# Altium schematic sheet USB To Serial.SchDoc
size A4
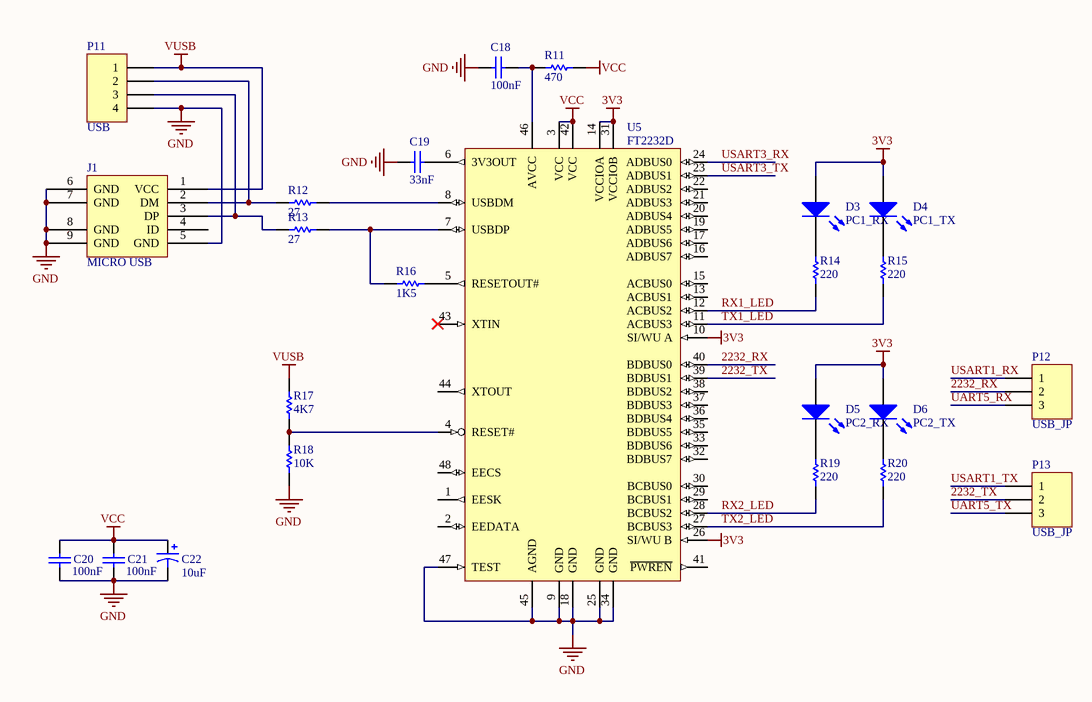
[diagram p0: USB To Serial.SchDoc]

## Parts
C18  100nF  [0603-CAP]
C19  33nF  [0603-CAP]
C20  100nF  [0603-CAP]
C21  100nF  [0603-CAP]
C22  10uF  [SV-C]
D3  PC1_RX  [CHIPLED_0603]
D4  PC1_TX  [CHIPLED_0603]
D5  PC2_RX  [CHIPLED_0603]
D6  PC2_TX  [CHIPLED_0603]
J1  MICRO USB  [USB_MICRO]
P11  USB  [HDR1X4]
P12  USB_JP  [HDR1X3]
P13  USB_JP  [HDR1X3]
R11  470  [0603-RES]
R12  27  [0603-RES]
R13  27  [0603-RES]
R14  220  [0603-RES]
R15  220  [0603-RES]
R16  1K5  [0603-RES]
R17  4K7  [0603-RES]
R18  10K  [0603-RES]
R19  220  [0603-RES]
R20  220  [0603-RES]
U5  FT2232D  [QFP-48N]

## Nets
3V3: D3.1(A) D4.1(A) D5.1(A) D6.1(A) U5.10(SI/WU_A) U5.14(VCCIOA) U5.26(SI/WU_B) U5.31(VCCIOB)
GND: C18.1 C19.1 C20.1 C21.1 C22.2 J1.5(GND) J1.6(GND) J1.7(GND) J1.8(GND) J1.9(GND) P11.4 R18.1 U5.9(GND) U5.18(GND) U5.25(GND) U5.34(GND) U5.45(AGND) U5.47(TEST)
VCC: C20.2 C21.2 C22.1 R11.2 U5.3(VCC) U5.42(VCC)
VUSB: J1.1(VCC) P11.1 R17.2
2232_RX: P12.2 U5.40(BDBUS0)
2232_TX: P13.2 U5.39(BDBUS1)
RX1_LED: R14.1 U5.12(ACBUS2)
RX2_LED: R19.1 U5.28(BCBUS2)
TX1_LED: R15.1 U5.11(ACBUS3)
TX2_LED: R20.1 U5.27(BCBUS3)
UART5_RX: P12.3
UART5_TX: P13.3
USART1_RX: P12.1
USART1_TX: P13.1
USART3_RX: U5.24(ADBUS0)
USART3_TX: U5.23(ADBUS1)
NetC18_2: C18.2 R11.1 U5.46(AVCC)
NetC19_2: C19.2 U5.6(3V3OUT)
NetD3_2: D3.2(K) R14.2
NetD4_2: D4.2(K) R15.2
NetD5_2: D5.2(K) R19.2
NetD6_2: D6.2(K) R20.2
NetJ1_2: J1.2(DM) P11.2 R12.1
NetJ1_3: J1.3(DP) P11.3 R13.1
NetR12_2: R12.2 U5.8(USBDM)
NetR13_2: R13.2 R16.1 U5.7(USBDP)
NetR16_2: R16.2 U5.5(RESETOUT#)
NetR17_1: R17.1 R18.2 U5.4(RESET#)

Not connected (* = marked no-connect by the designer): J1 4(ID); U5 1(EESK) 2(EEDATA) 13(ACBUS1) 15(ACBUS0) 16(ADBUS7) 17(ADBUS6) 19(ADBUS5) 20(ADBUS4) 21(ADBUS3) 22(ADBUS2) 29(BCBUS1) 30(BCBUS0) 32(BDBUS7) 33(BDBUS6) 35(BDBUS5) 36(BDBUS4) 37(BDBUS3) 38(BDBUS2) 41(~{PWREN}) 43(XTIN)* 44(XTOUT) 48(EECS)

## Library data of the parts
C18-C21 = Cap: Capacitor; Published: 8-Jun-2000; LatestRevisionDate: 17-Jul-2002; LatestRevisionNote: Re-released for DXP Platform.; PackageReference: RAD-0.3; Publisher: Altium Limited; PackageDescription: Radial Cap, Thru-Hole; 2 Leads; 0.3 in Pin Spacing
  C18 C20 C21: Value: 100nF
  C19: Value: 33nF
C22 = Cap Pol: Polarized Capacitor (Axial); Published: 8-Jun-2000; LatestRevisionDate: 17-Jul-2002; LatestRevisionNote: Re-released for DXP Platform.; PackageReference: POLAR0.8; Publisher: Altium Limited; PackageDescription: Polarized Capacitor; 2 Leads; Value: 10uF
D3-D6 = LED: Typical INFRARED GaAs LED; Published: 8-Jun-2000; LatestRevisionDate: 08-Jul-2005; LatestRevisionNote: Mech Layer 1 removed.; PackageReference: LED-0; Publisher: Altium Limited; PackageDescription: LED; 2 Leads
P11 = Header 4: Header, 4-Pin; LatestRevisionDate: 17-Jul-2002; LatestRevisionNote: Re-released for DXP Platform.; Publisher: Altium Limited
P12 P13 = Header 3: Header, 3-Pin; LatestRevisionDate: 17-Jul-2002; LatestRevisionNote: Re-released for DXP Platform.; Publisher: Altium Limited
R11-R20 = Res: Resistor; Published: 8-Jun-2000; LatestRevisionDate: 17-Jul-2002; LatestRevisionNote: Re-released for DXP Platform.; PackageReference: AXIAL-0.3; Publisher: Altium Limited; PackageDescription: Axial Device, Thru-Hole; 2 Leads; 0.3 in Pin Spacing
  R11: Value: 470
  R12 R13: Value: 27
  R14 R15 R19 R20: Value: 220
  R16: Value: 1K5
  R17: Value: 4K7
  R18: Value: 10K
U5 = FT2232D: Dual USB UART/FIFO Chip, LQFP-48; Published: 19-Aug-2010; DatasheetVersion: ver 2.03, May-2010; PackageVersion: 2005; PackageReference: LQFP-48; Publisher: Altium Limited; PackageDescription: 48-Pin Thin Quad Flat Pack 0.5 mm Pitch; ComponentLink1Description: Manufacturer Link; ComponentLink1URL: http://www.ftdichip.com/Products/ICs/FT2232D.htm; ComponentLink2Description: Datasheet; ComponentLink2URL: http://www.ftdichip.com/Support/Documents/DataSheets/ICs/DS_FT2232D.pdf